# EAGLE design sensore-linea (EAGLE 9.2.2)
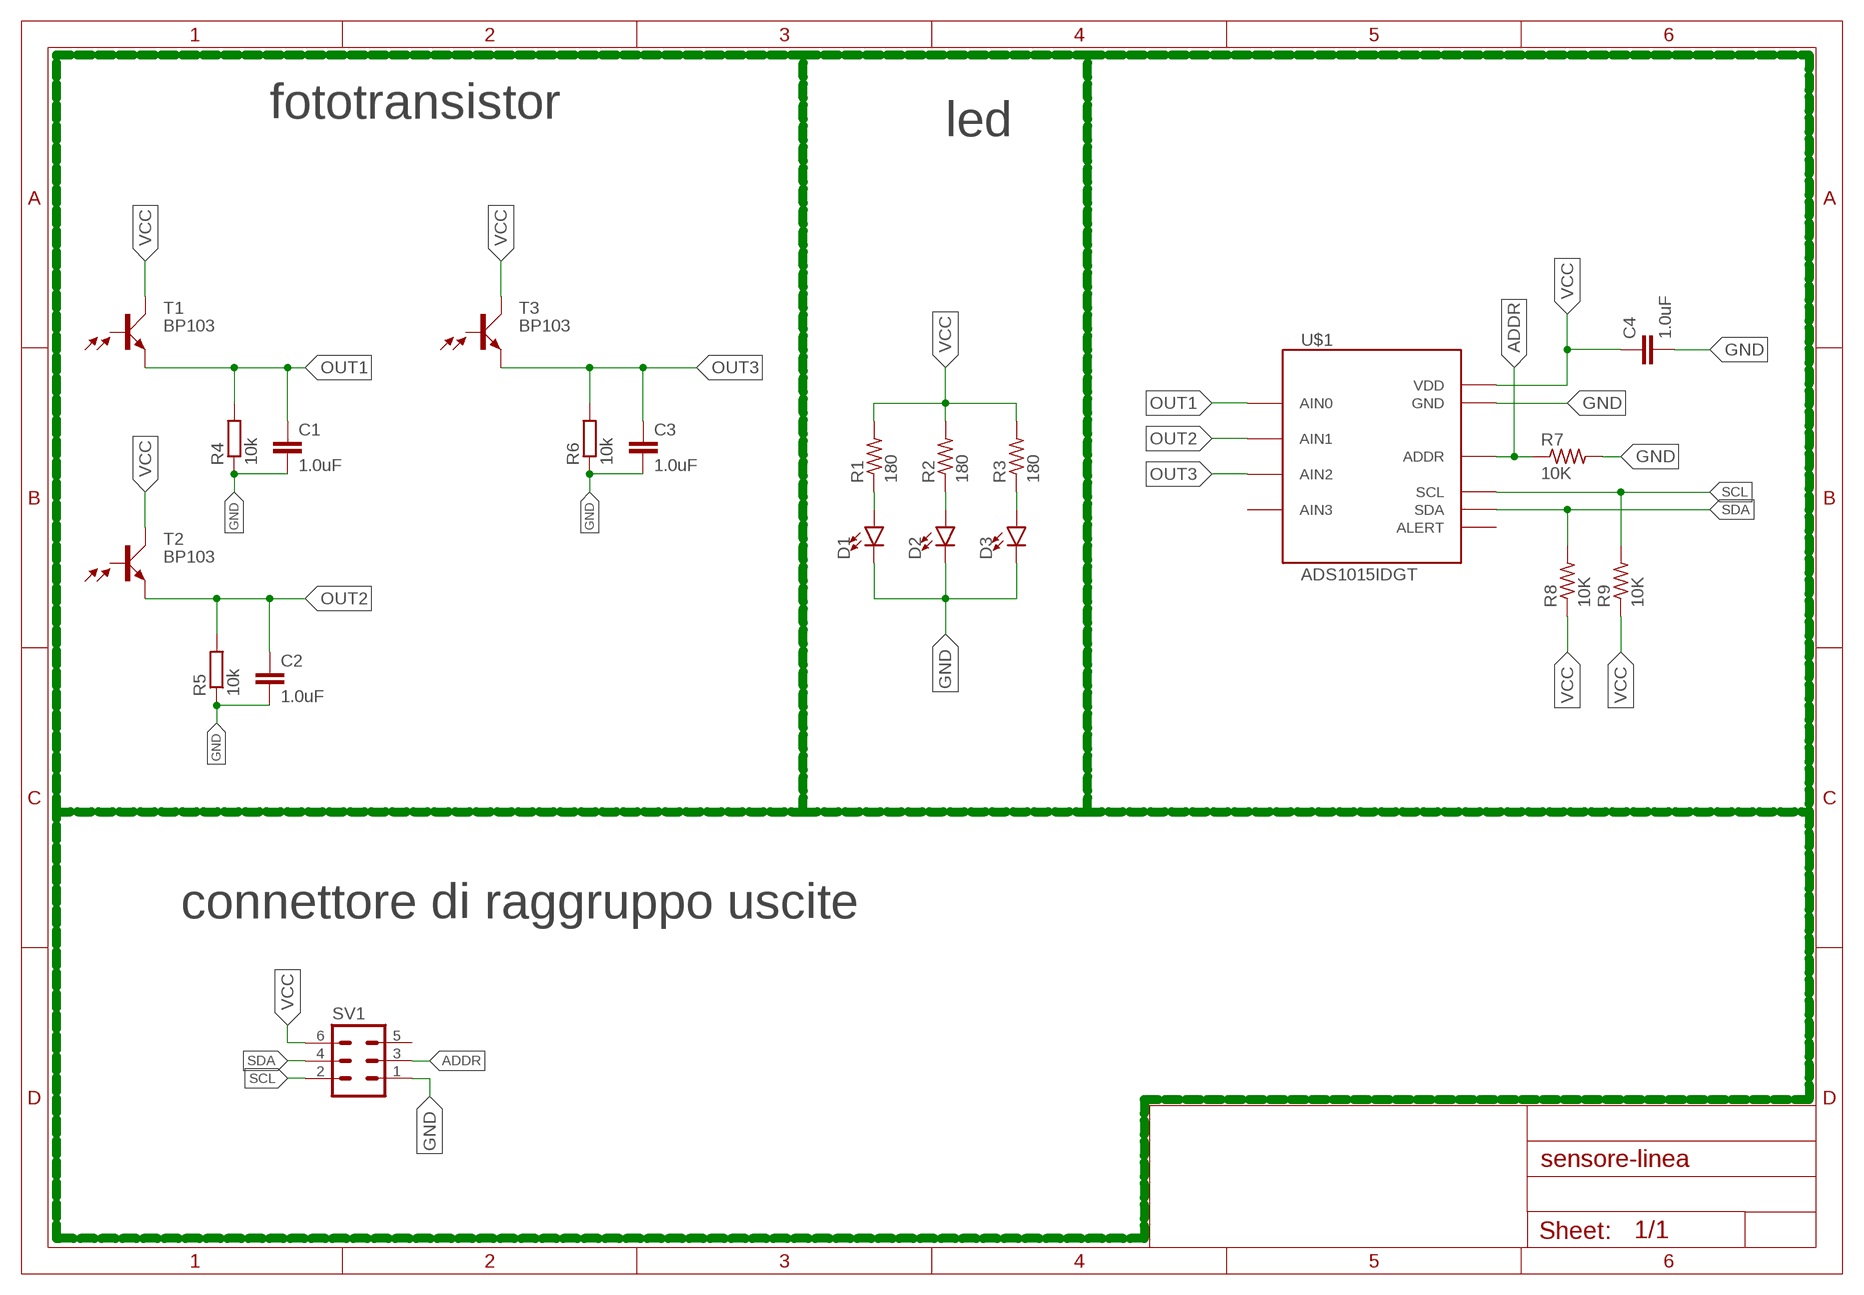
[diagram p0: schematic, sheet 1]

## Parts
C1  1.0uF  2.2UF-1206-50V-10%  [1206]
C2  1.0uF  2.2UF-1206-50V-10%  [1206]
C3  1.0uF  2.2UF-1206-50V-10%  [1206]
C4  1.0uF  1.0UF-0402-16V-10%  [0402]
D1  LED3MM  [LED_3MM]
D2  LED3MM  [LED_3MM]
D3  LED3MM  [LED_3MM]
R1  180  R-US_0204/7  [0204/7]
R2  180  R-US_0204/7  [0204/7]
R3  180  R-US_0204/7  [0204/7]
R4  10k  R-EU_R1206  [R1206]
R5  10k  R-EU_R1206  [R1206]
R6  10k  R-EU_R1206  [R1206]
R7  10K  R-US_0204/7  [0204/7]
R8  10K  R-US_0204/7  [0204/7]
R9  10K  R-US_0204/7  [0204/7]
SV1  MA03-2  [MA03-2]
T1  BP103  [BP103]
T2  BP103  [BP103]
T3  BP103  [BP103]
U$1  ADS1015IDGT  [MSOP10_0.5]

## Nets
ADDR: R7.1 SV1.3 U$1.1(ADDR)
GND: C1.2 C2.2 C3.2 C4.2 D1.K(C) D2.K(C) D3.K(C) R4.1 R5.1 R6.1 R7.2 SV1.1 U$1.3(GND)
N$2: D1.A R1.1
N$3: D2.A R2.1
N$4: D3.A R3.1
OUT1: C1.1 R4.2 T1.E U$1.4(AIN0)
OUT2: C2.1 R5.2 T2.E U$1.5(AIN1)
OUT3: C3.1 R6.2 T3.E U$1.6(AIN2)
SCL: R9.2 SV1.2 U$1.10(SCL)
SDA: R8.2 SV1.4 U$1.9(SDA)
VCC: C4.1 R1.2 R2.2 R3.2 R8.1 R9.1 SV1.6 T1.C T2.C T3.C U$1.8(VDD)
Unconnected: SV1.5 T1.B T2.B T3.B U$1.2(ALERT) U$1.7(AIN3)

## Notes on the sheet
- fototransistor
- led
- connettore di raggruppo uscite

## Library data of the parts
C1-C3 = SparkFun-Capacitors:2.2UF: 2.2µF ceramic capacitors A capacitor is a passive two-terminal electrical component used to store electrical energy temporarily in an electric field.; PROD_ID: CAP-10009; VALUE: 2.2uF
C4 = SparkFun-Capacitors:1.0UF: 1µF ceramic capacitors A capacitor is a passive two-terminal electrical component used to store electrical energy temporarily in an electric field.; PROD_ID: CAP-12417
D1-D3 = SparkFun-LED:LED: LED (Generic) Standard schematic elements and footprints for 5mm, 3mm, 1206, and 0603 sized LEDs. Generic LEDs with no color specified.; PROD_ID: DIO-08794
R1-R3 = rcl:R-US_: RESISTOR, American symbol; SPICEPREFIX: R
R4-R6 = rcl:R-EU_: RESISTOR, European symbol; SPICEPREFIX: R
R7-R9 = resistor:R-US_: RESISTOR, American symbol
SV1 = con-lstb:MA03-2: PIN HEADER; OC_FARNELL: unknown; OC_NEWARK: unknown
T1-T3 = opto-trans-siemens:BP103: PHOTO TRANSISTOR; OC_FARNELL: unknown; OC_NEWARK: unknown
U$1 = bt_adc:ADS1015: Ti ADS1015 12-bit ADC Ultra-Small, Low-Power, 12-Bit Analog-to-Digital Converter with Internal Reference The ADS1013, ADS1014, and ADS1015 are precision analog-to-digital converters (ADCs) with 12 bits of resolution offered in an ultra-small, leadless QFN-10 package or an MSOP-10 package. \ Source: http://focus.ti.com/docs/prod/folders/print/ads1015.html

## Board
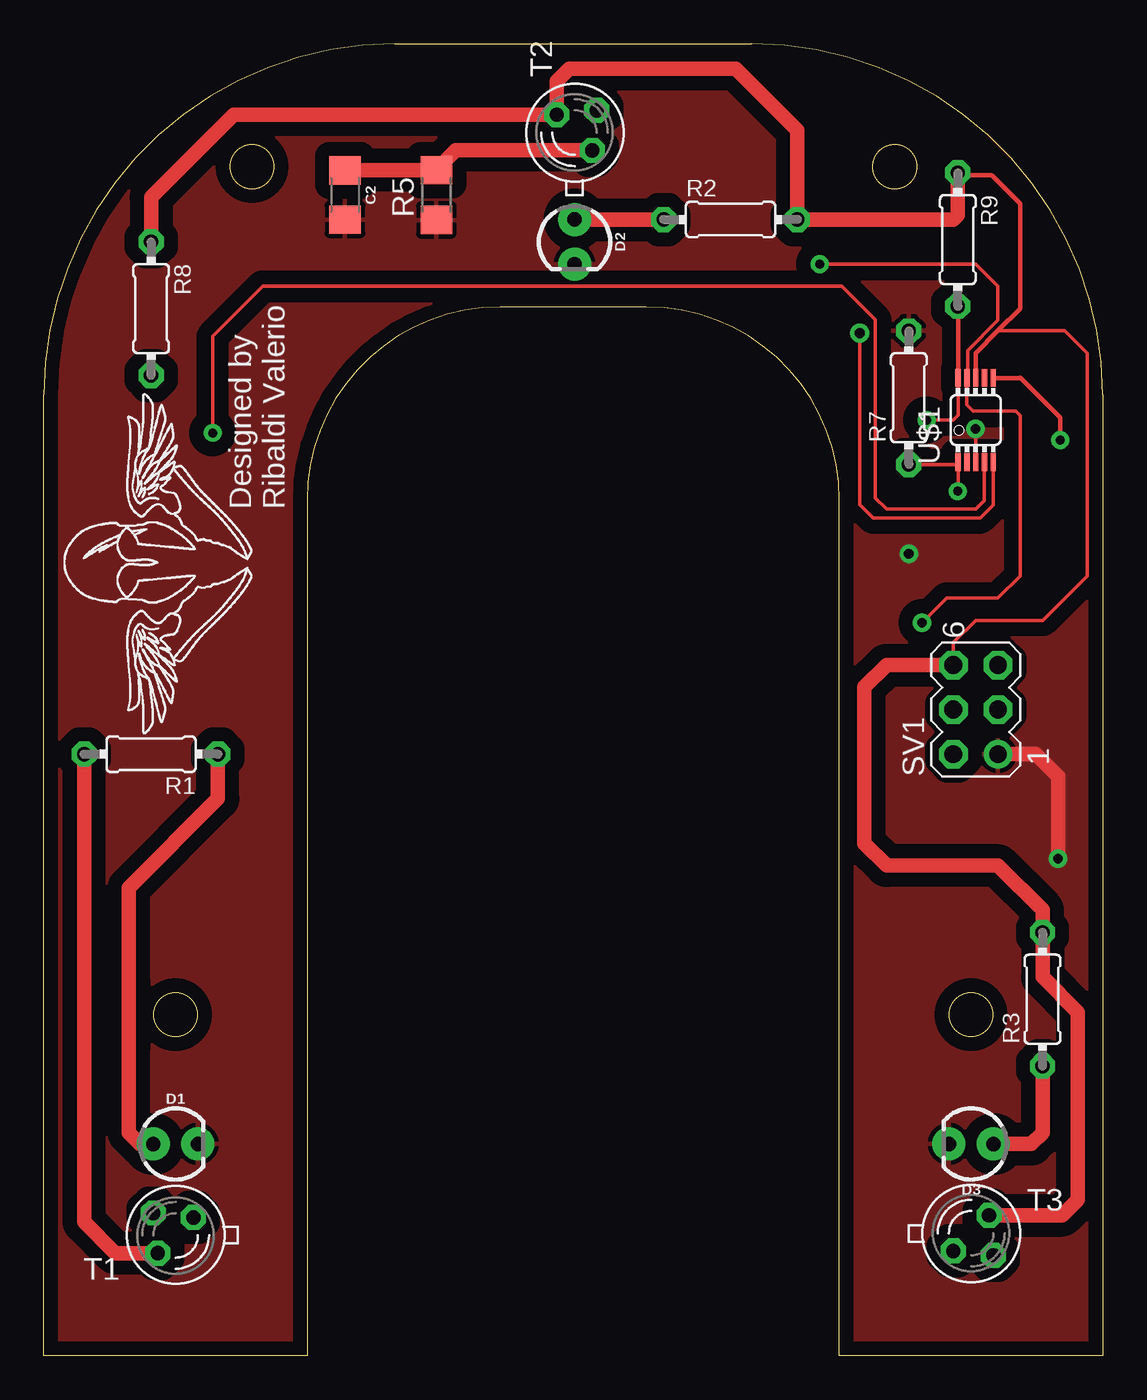
[diagram p1: board, top side]
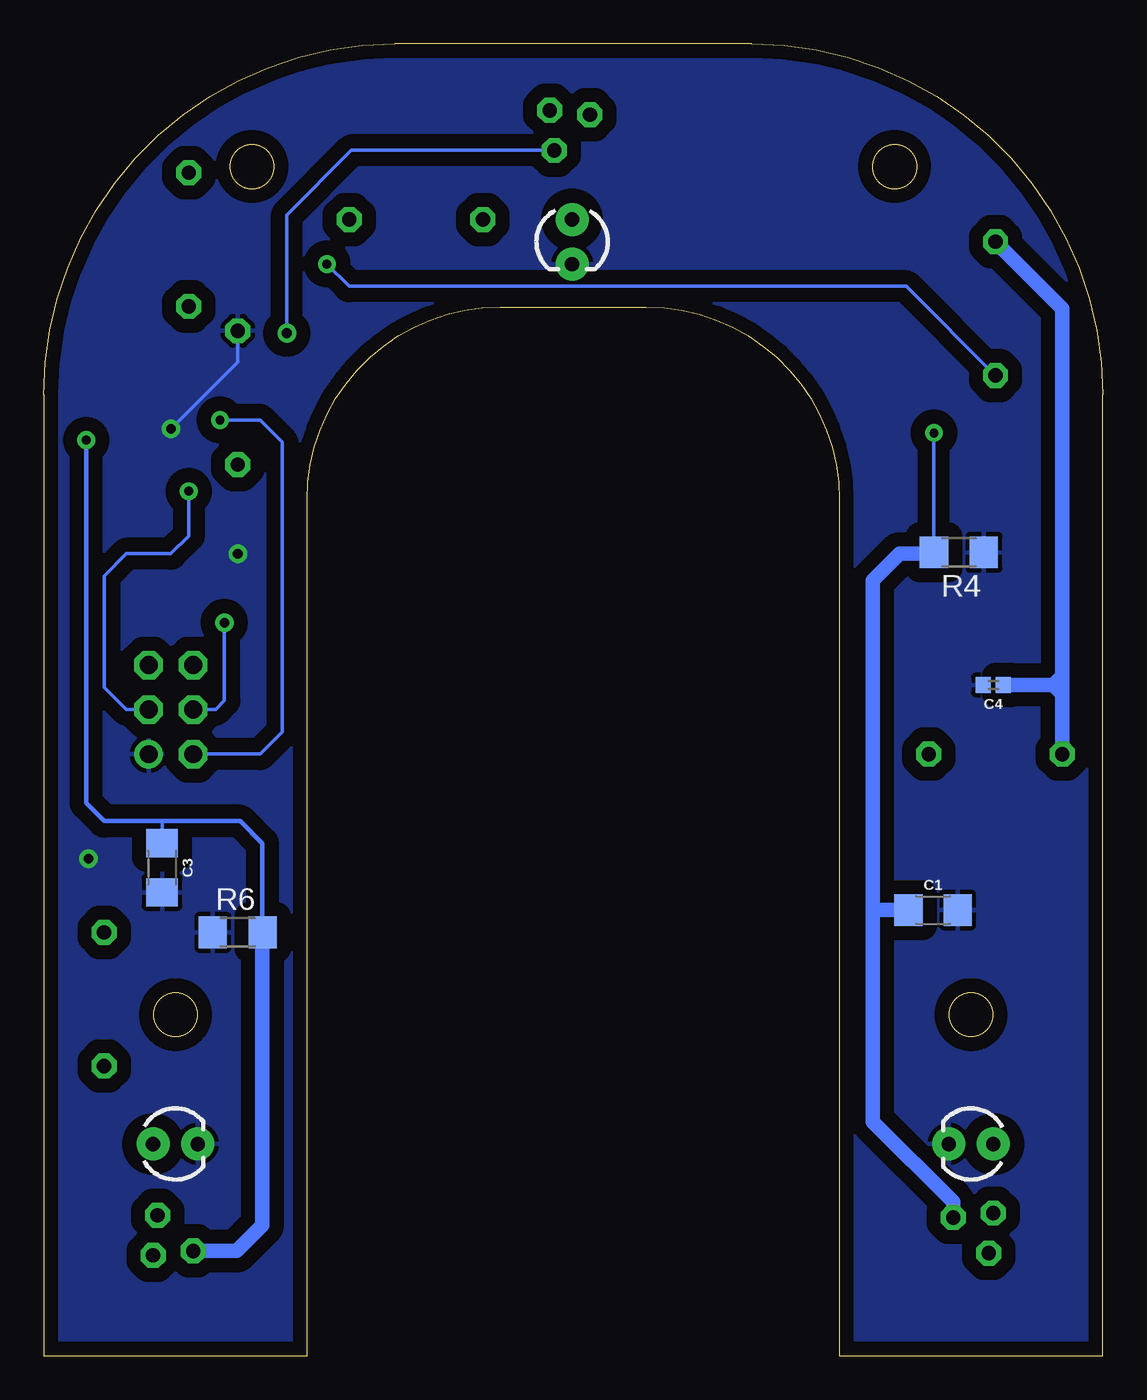
[diagram p2: board, bottom side, seen from below]

Size 60.34 x 74.78 mm. Coordinates in mm from the lower left corner, seen from the top.
Outline: 26,59.78 arc90 15,48.78 15,0 0,0 0,54.78 arc-90 20,74.78 40.34,74.78 arc-90 60.34,54.78 60.34,0 45.34,0 45.34,48.78 arc90 34.34,59.78 26,59.78
Outline: circle at 11.86,67.78 radius 1.25
Outline: circle at 48.49,67.78 radius 1.25
Outline: circle at 7.5,19.43 radius 1.25
Outline: circle at 52.84,19.43 radius 1.25
Copper layers (1*16): Top 0.035mm / dielectric 1.5mm / Bottom 0.035mm
Design rules "SparkFun": minimum track width 8mil, minimum drill 20mil, track to track 8mil, track to pad 8mil, pad to pad 8mil, via to via 8mil, smd to smd 8mil, copper to edge 10mil, drill to drill 8mil, minimum pad ring 12mil, minimum via ring 10mil, stop-mask expansion 4mil, vias tented up to drill 25mil, thermal gap 10mil

### Footprints (pad centres in the part's own frame; a part is rotated, then mirrored left to right if it is on the bottom)
1206 = smd 1.6 x 1.8: 1 -1.4,0; 2 1.4,0
0402 = smd 0.85 x 0.9: 1 -0.58,0; 2 0.58,0
LED_3MM = drill 0.813 pad 1.88: A -1.27,0; K 1.27,0
0204/7 = drill 0.813 octagon: 1 -3.81,0; 2 3.81,0
R1206 = smd 1.6 x 1.803: 1 -1.422,0; 2 1.422,0
MA03-2 = drill 1.016: 1 -2.54,-1.27 | drill 1.016 octagon: 2 -2.54,1.27; 3 0,-1.27; 4 0,1.27; 5 2.54,-1.27; 6 2.54,1.27
BP103 = drill 0.813 octagon: B 1.27,-1.27; C 1.016,1.016; E -1.016,-1.016
MSOP10_0.5 = smd 0.3 x 1.02: 1 -1,-2.4; 2 -0.5,-2.4; 3 0,-2.4; 4 0.5,-2.4; 5 1,-2.4; 6 1,2.4; 7 0.5,2.4; 8 0,2.4; 9 -0.5,2.4; 10 -1,2.4

### Placement (x,y rotation side)
C1  9.67,25.4 0 bottom
C2  17.16,66.17 270 top
C3  53.61,27.81 270 bottom
C4  6.24,38.23 180 bottom
D1  7.51,12.06 0 top
D2  30.24,63.5 270 top
D3  52.85,12.06 180 top
R1  6.11,34.29 180 top
R2  39.13,64.77 0 top
R3  56.91,20.32 90 top
R4  8.19,45.8 180 bottom
R5  22.37,66.17 90 top
R6  49.29,24.13 0 bottom
R7  49.29,54.61 90 top
R8  6.11,59.69 270 top
R9  52.08,63.63 270 top
SV1  53.1,36.83 90 top
T1  7.51,6.86 180 top
T2  30.24,69.72 90 top
T3  52.85,6.98 0 top
U$1  53.1,53.34 0 top

### Tracks (layer width: path | path; a pad name or v marks a point on that pad's centre or on a via)
ADDR  (via drill 0.51)
  Top 0.203: R7.1 51.96,50.8 U$1.1 52.1,49.29 v52.08,49.28
  Bottom 0.203: v52.08,49.28 52.08,46.74 53.1,45.72 55.64,45.72 56.91,44.45 56.91,38.1 55.64,36.83 SV1.3
GND  (via drill 0.55)
  Top 0.203: U$1.3 v53.1,52.83
  Top 0.813: SV1.1 56.53,34.29 57.8,33.02 v57.8,28.32
  Bottom 0.203: v53.1,52.83 49.29,56.64 R7.2
  other vias: 49.29,45.72
  pour Bottom (isolate 0.813): -2.78,-2.54 63.26,-2.54 63.26,77.47 -2.78,77.47
  pour Top (isolate 0.813): -1.51,-1.27 61.99,-1.27 61.99,76.2 -1.51,76.2
N$2
  Top 0.813: D1.A 5.48,12.06 4.84,12.7 4.84,17.58 4.83,17.59 4.83,21.27 4.84,21.29 4.84,26.67 9.92,31.75 R1.1
N$3
  Top 0.813: D2.A R2.1
N$4
  Top 0.813: R3.1 56.91,12.7 56.28,12.06 D3.A
OUT1  (via drill 0.51)
  Top 0.203: U$1.4 53.6,48.76 53.1,48.26 48.02,48.26 47.39,48.89 47.39,59.05 45.48,60.96 12.46,60.96 9.61,58.11 v9.61,52.6
  Bottom 0.203: v9.61,52.6 | R4.2 v9.61,52.6
  Bottom 0.813: T1.E 8.52,8.76 13.09,13.33 13.09,25.4 | 13.09,25.4 13.09,44.2 11.57,45.72 9.69,45.72 R4.2 | C1.1 13.09,25.4
OUT2  (via drill 0.55)
  Top 0.203: U$1.5 54.1,48.5 53.35,47.75 47.26,47.75 46.5,48.51 v46.5,58.29
  Top 0.813: T2.E 23.48,68.71 R5.2 17.18,67.59
  Top 1.016: 17.18,67.59 C2.1
  Bottom 0.203: v46.5,58.29 46.5,65.02 42.81,68.71 T2.E
OUT3  (via drill 0.51)
  Top 0.254: U$1.6 55.63,55.74 55.64,55.75 57.93,53.47 v57.93,52.2
  Bottom 0.203: C3.1 53.61,30.48
  Bottom 0.254: R6.2 47.89,24.16 47.89,29.21 49.16,30.48 53.61,30.48 56.91,30.48 57.93,31.5 v57.93,52.2
  Bottom 0.813: 47.89,24.16 47.89,7.43 49.36,5.97 T3.E
SCL  (via drill 0.51)
  Top 0.203: U$1.10 52.1,53.61 51.83,53.34 v50.31,53.34
  Top 0.254: R9.2 52.1,59.8 U$1.10
  Bottom 0.203: SV1.2 48.02,34.29 46.75,35.56 46.75,52.07 48.02,53.34 v50.31,53.34
SDA  (via drill 0.51, 0.55)
  Top 0.203: v50.05,41.78 51.45,43.18 54.37,43.18 55.64,44.45 55.64,53.59 55.39,53.85 52.97,53.85 52.6,54.22 U$1.9 52.65,55.78 52.65,57.31 54.37,59.03 54.37,60.96 53.1,62.23 v44.21,62.23
  Bottom 0.203: SV1.4 50.56,36.83 50.05,37.34 v50.05,41.78 | R8.2 11.19,60.96 42.94,60.96 v44.21,62.23
VCC
  Top 0.203: SV1.6 51.83,40.64 53.1,41.91 56.91,41.91 59.45,44.45 59.45,57.15 58.18,58.42 54.37,58.42
  Top 0.254: U$1.8 53.1,57.15 54.37,58.42 55.64,59.69 55.64,65.68 54.03,67.3 52.23,67.3 R9.1
  Top 0.813: T1.C 4.08,5.84 2.3,7.62 R1.2 | T3.C 58.03,8 58.92,8.89 58.92,19.58 56.91,21.59 R3.2 56.91,25.4 54.37,27.94 48.02,27.94 46.76,29.2 46.76,38.11 48.02,39.37 SV1.6 | R8.1 6.11,66.04 10.81,70.74 T2.C 29.22,72.64 29.94,73.36 39.43,73.36 42.94,69.85 R2.2 51.83,64.77 52.08,65.02 R9.1
  Bottom 0.813: R1.2 2.3,37.72 | 2.3,37.72 2.81,38.23 | 2.81,38.23 C4.1 | R8.1 2.3,59.69 2.3,38.99 2.3,38.73 | 2.3,38.73 2.3,37.72 | 2.3,38.73 2.81,38.23

### Text on the board
tNames: Designed by / Ribaldi Valerio